# Altium project Infrared_Receive.PrjPCB
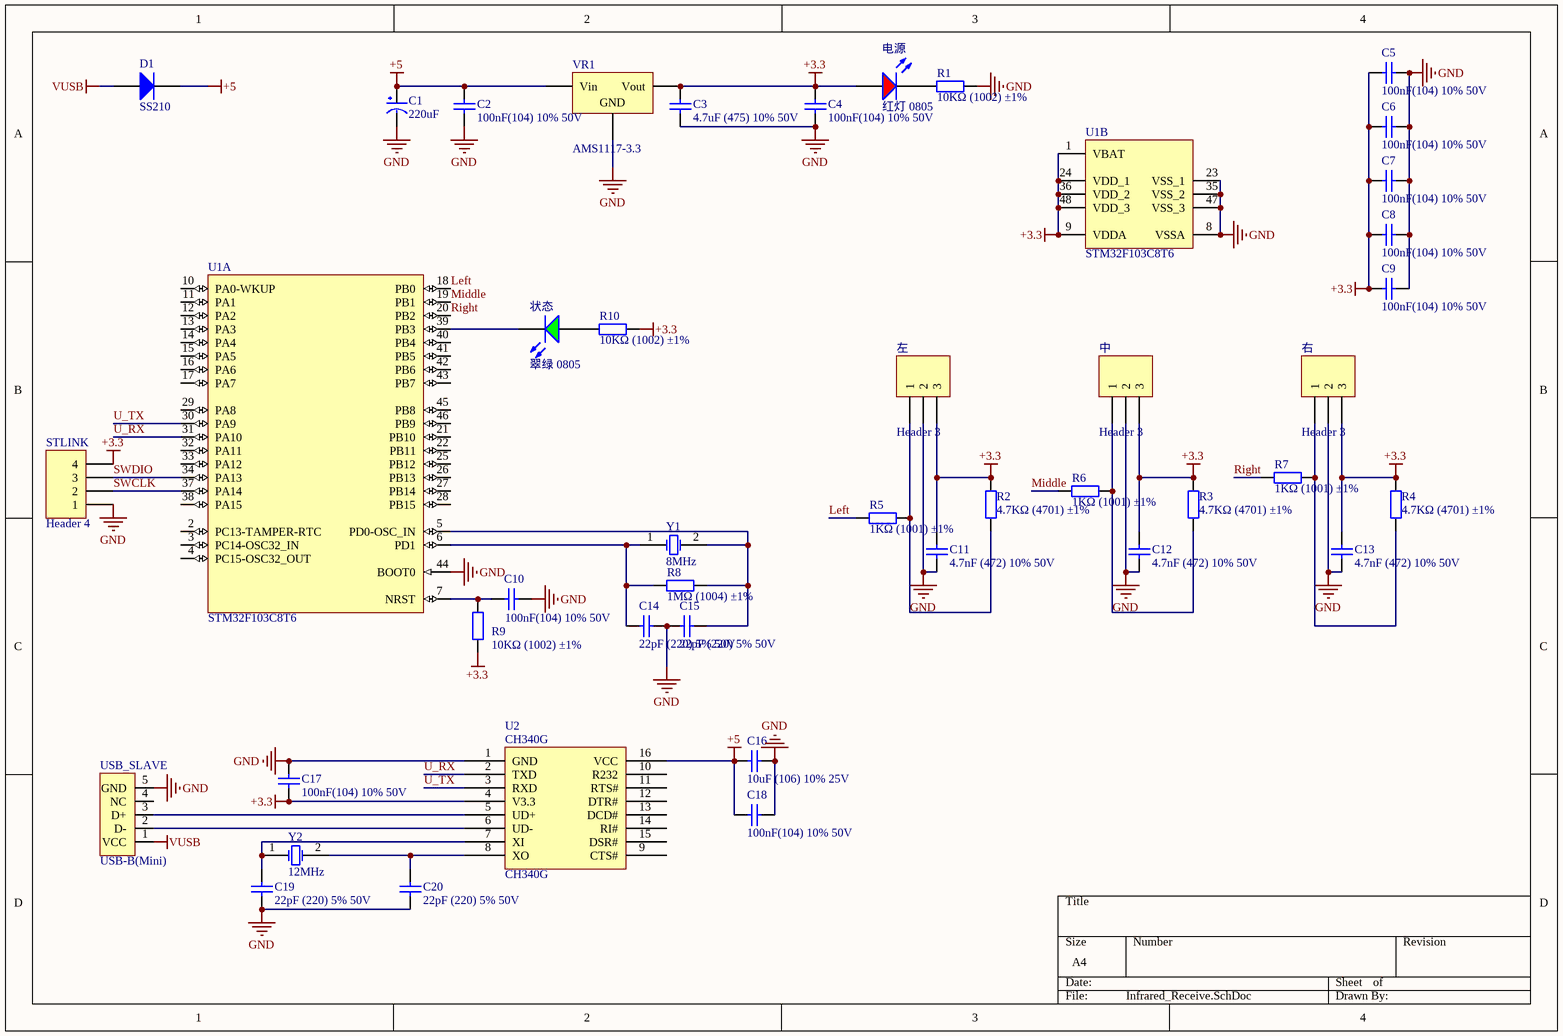
[diagram p0: Infrared_Receive.SchDoc]
1 sheet, 43 parts. Net scope: global (net labels, ports and power ports of the same name join across sheets).
Board file: Infrared_Receive.PcbDoc

## Sheet Infrared_Receive.SchDoc
size A4

### Parts
C1  220uF  [CC6.56.5]
C2  100nF(104) 10% 50V  [LC-0805_C]
C3  4.7uF (475) 10% 50V  [LC-1206_C]
C4  100nF(104) 10% 50V  [LC-0805_C]
C5  100nF(104) 10% 50V  [LC-0805_C]
C6  100nF(104) 10% 50V  [LC-0805_C]
C7  100nF(104) 10% 50V  [LC-0805_C]
C8  100nF(104) 10% 50V  [LC-0805_C]
C9  100nF(104) 10% 50V  [LC-0805_C]
C10  100nF(104) 10% 50V  [LC-0805_C]
C11  4.7nF (472) 10% 50V  [LC-0805_C]
C12  4.7nF (472) 10% 50V  [LC-0805_C]
C13  4.7nF (472) 10% 50V  [LC-0805_C]
C14  22pF (220) 5% 50V  [LC-0805_C]
C15  22pF (220) 5% 50V  [LC-0805_C]
C16  10uF (106) 10% 25V  [LC-0805_C]
C17  100nF(104) 10% 50V  [LC-0805_C]
C18  100nF(104) 10% 50V  [LC-0805_C]
C19  22pF (220) 5% 50V  [LC-0805_C]
C20  22pF (220) 5% 50V  [LC-0805_C]
D1  SS210  [LC-SMA(DO-214AC)_S1]
R1  10KΩ (1002) ±1%  [LC-0805_R]
R2  4.7KΩ (4701) ±1%  [LC-0805_R]
R3  4.7KΩ (4701) ±1%  [LC-0805_R]
R4  4.7KΩ (4701) ±1%  [LC-0805_R]
R5  1KΩ (1001) ±1%  [LC-0805_R]
R6  1KΩ (1001) ±1%  [LC-0805_R]
R7  1KΩ (1001) ±1%  [LC-0805_R]
R8  1MΩ (1004) ±1%  [LC-0805_R]
R9  10KΩ (1002) ±1%  [LC-0805_R]
R10  10KΩ (1002) ±1%  [LC-0805_R]
STLINK  Header 4  [HDR1X4]
U1  STM32F103C8T6  [LC-LQFP-48_7x7x05P]  (parts A,B of 2)
U2  CH340G  [LC-SOIC-16_150mil]
USB_SLAVE  USB-B(Mini)  [USB/SM0.8-6H5]
VR1  AMS1117-3.3  [LC-SOT-223]
Y1  8MHz  [XTAL_US]
Y2  12MHz  [XTAL_US]
中  Header 3  [HDR1X3]
右  Header 3  [HDR1X3]
左  Header 3  [HDR1X3]
状态  翠绿 0805  [LC-0805_LED_S1]
电源  红灯 0805  [LC-0805_LED_S1]

### Nets
+3.3: C3.2 C4.2 C5.2 C6.2 C7.2 C8.2 C9.2 C11.2 C12.2 C13.2 C17.1 R2.2 R3.2 R4.2 R9.1 R10.1 STLINK.4 U1.1(VBAT) U1.9(VDDA) U1.24(VDD_1) U1.36(VDD_2) U1.48(VDD_3) U2.4(V3.3) VR1.2(Vout) 中.3 右.3 左.3 电源.A
+5: C1.1(VCC) C2.2 C16.1 C18.1 D1.2(K) U2.16(VCC) VR1.3(Vin)
GND: C1.2(GND) C2.1 C3.1 C4.1 C5.1 C6.1 C7.1 C8.1 C9.1 C10.1 C11.1 C12.1 C13.1 C14.2 C15.1 C16.2 C17.2 C18.2 C19.1 C20.1 R1.1 STLINK.1 U1.8(VSSA) U1.23(VSS_1) U1.35(VSS_2) U1.44(BOOT0) U1.47(VSS_3) U2.1(GND) USB_SLAVE.5(GND) VR1.1(GND) 中.2 右.2 左.2
VUSB: D1.1(A) USB_SLAVE.1(VCC)
Left: R5.1 U1.18(PB0)
Middle: R6.1 U1.19(PB1)
Right: R7.1 U1.20(PB2)
SWCLK: STLINK.2 U1.37(PA14)
SWDIO: STLINK.3 U1.34(PA13)
U_RX: U1.31(PA10) U2.2(TXD)
U_TX: U1.30(PA9) U2.3(RXD)
NetC10_2: C10.2 R9.2 U1.7(NRST)
NetC14_1: C14.1 R8.1 U1.6(PD1) Y1.1(OSC1)
NetC15_2: C15.2 R8.2 U1.5(PD0-OSC_IN) Y1.2(OSC2)
NetC19_2: C19.2 U2.7(XI) Y2.1(OSC1)
NetC20_2: C20.2 U2.8(XO) Y2.2(OSC2)
NetR1_2: R1.2 电源.K
NetR2_1: R2.1 R5.2 左.1
NetR3_1: R3.1 R6.2 中.1
NetR4_1: R4.1 R7.2 右.1
NetR10_2: R10.2 状态.A
NetU1_39: U1.39(PB3) 状态.K
NetU2_5: U2.5(UD+) USB_SLAVE.3(D+)
NetU2_6: U2.6(UD-) USB_SLAVE.2(D-)

Not connected (* = marked no-connect by the designer): U1 2(PC13-TAMPER-RTC) 3(PC14-OSC32_IN) 4(PC15-OSC32_OUT) 10(PA0-WKUP) 11(PA1) 12(PA2) 13(PA3) 14(PA4) 15(PA5) 16(PA6) 17(PA7) 21(PB10) 22(PB11) 25(PB12) 26(PB13) 27(PB14) 28(PB15) 29(PA8) 32(PA11) 33(PA12) 38(PA15) 40(PB4) 41(PB5) 42(PB6) 43(PB7) 45(PB8) 46(PB9); U2 9(CTS#) 10(R232) 11(RTS#) 12(DTR#) 13(DCD#) 14(RI#) 15(DSR#); USB_SLAVE 4(NC)

### Library data of the parts
C1 = CAP
C2 C4-C10 C17 C18 = 0805 100nF(104) 10% 50V: 贴片电容; ComponentLink1Description: 供应商链接; ComponentLink1URL: http://www.szlcsc.com/product/details_50686.html; Package: 0805; Supplier: LC; SuppliersPartNumber: C49678
C3 = 1206 4.7uF (475) 10% 50V: 贴片电容; ComponentLink1Description: 供应商链接; ComponentLink1URL: http://www.szlcsc.com/product/details_30577.html; Package: 1206; Supplier: LC; SuppliersPartNumber: C29823
C11-C13 = 0805 4.7nF (472) 10% 50V: 贴片电容; ComponentLink1Description: 供应商链接; ComponentLink1URL: http://www.szlcsc.com/product/details_2096.html; Package: 0805; Supplier: LC; SuppliersPartNumber: C1744
C14 C15 C19 C20 = 0805 22pF (220) 5% 50V: 贴片电容; ComponentLink1Description: 供应商链接; ComponentLink1URL: http://www.szlcsc.com/product/details_2156.html; Package: 0805; Supplier: LC; SuppliersPartNumber: C1804
C16 = 0805 10uF (106) 10% 25V: 贴片电容; ComponentLink1Description: 供应商链接; ComponentLink1URL: http://www.szlcsc.com/product/details_16532.html; Package: 0805; Supplier: LC; SuppliersPartNumber: C15850
D1 = SMA(DO-214AC) SS210: 二极管; ComponentLink1Description: 供应商链接; ComponentLink1URL: http://www.szlcsc.com/product/details_15669.html; Package: SMA(DO-214AC); Supplier: LC; SuppliersPartNumber: C14996
R1 R9 R10 = 0805 10KΩ (1002) 1%: 贴片电阻; ComponentLink1Description: 供应商链接; ComponentLink1URL: http://www.szlcsc.com/product/details_18102.html; Package: 0805; Supplier: LC; SuppliersPartNumber: C17414
R2-R4 = 0805 4.7KΩ (4701) 1%: 贴片电阻; ComponentLink1Description: 供应商链接; ComponentLink1URL: http://www.szlcsc.com/product/details_18361.html; Package: 0805; Supplier: LC; SuppliersPartNumber: C17673
R5-R7 = 0805 1KΩ (1001) 1%: 贴片电阻; ComponentLink1Description: 供应商链接; ComponentLink1URL: http://www.szlcsc.com/product/details_18201.html; Package: 0805; Supplier: LC; SuppliersPartNumber: C17513
R8 = 0805 1MΩ (1004) 1%: 贴片电阻; ComponentLink1Description: 供应商链接; ComponentLink1URL: http://www.szlcsc.com/product/details_18202.html; Package: 0805; Supplier: LC; SuppliersPartNumber: C17514
STLINK = Header 4: Header, 4-Pin; LatestRevisionDate: 17-Jul-2002; LatestRevisionNote: Re-released for DXP Platform.; Publisher: Altium Limited
U1 = STM32F103C8T6: ARM; ComponentLink1Description: 供应商链接; ComponentLink1URL: http://www.szlcsc.com/product/details_9243.html; Package: LQFP-48_7x7x05P; Supplier: LC; SuppliersPartNumber: C8734
U2 = CH340G: USB; ComponentLink1Description: 供应商链接; ComponentLink1URL: http://www.szlcsc.com/product/details_14927.html; Package: SOIC-16_150mil; Supplier: LC; SuppliersPartNumber: C14267
USB_SLAVE = USB5
VR1 = SOT-223 AMS1117-3.3: 低压差线性稳压(LDO); ComponentLink1Description: 供应商链接; ComponentLink1URL: http://www.szlcsc.com/product/details_6652.html; Package: SOT-223; Supplier: LC; SuppliersPartNumber: C6186
Y1 Y2 = XTAL: Crystal Oscillator; Published: 8-Jun-2000; LatestRevisionDate: 17-Jul-2002; LatestRevisionNote: Re-released for DXP Platform.; Publisher: Altium Limited
中 右 左 = Header 3: Header, 3-Pin; LatestRevisionDate: 17-Jul-2002; LatestRevisionNote: Re-released for DXP Platform.; Publisher: Altium Limited
状态 = 0805 翠绿: 发光二极管; ComponentLink1Description: 供应商链接; ComponentLink1URL: http://www.szlcsc.com/product/details_2670.html; Package: 0805; Supplier: LC; SuppliersPartNumber: C2297
电源 = 0805 红灯: 发光二极管; ComponentLink1Description: 供应商链接; ComponentLink1URL: http://www.szlcsc.com/product/details_2668.html; Package: 0805; Supplier: LC; SuppliersPartNumber: C2295